# EAGLE design v1 (EAGLE 9.4.1)
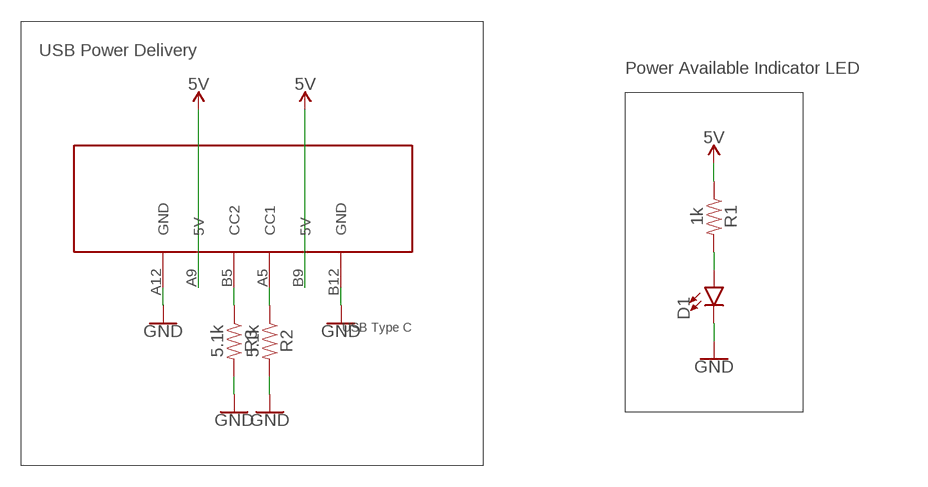
[diagram p0: schematic, sheet 1]

## Parts
D1  LED1206  [LED-1206]
R1  1k  0.75OHM-0805-1/4W-1%  [0805]
R2  5.1k  0.75OHM-0805-1/4W-1%  [0805]
R3  5.1k  0.75OHM-0805-1/4W-1%  [0805]
U$1  USBC6PIN  [USBC6PIN]

## Nets
5V: R1.1 U$1.A9(5V) U$1.B9(5V)
GND: D1.C R2.2 R3.2 U$1.A12(GND) U$1.B12(GND)
N$1: R3.1 U$1.B5(CC2)
N$2: R2.1 U$1.A5(CC1)
N$3: D1.A R1.2

## Notes on the sheet
- USB Power Delivery
- Power Available Indicator LED

## Library data of the parts
D1 = SparkFun-LED:LED: LED (Generic) Standard schematic elements and footprints for 5mm, 3mm, 1206, and 0603 sized LEDs. Generic LEDs with no color specified.
R1-R3 = SparkFun-Resistors:0.75OHM: 0.75Ω resistor A resistor is a passive two-terminal electrical component that implements electrical resistance as a circuit element. Resistors act to reduce current flow, and, at the same time, act to lower voltage levels within circuits. - Wikipedia; PROD_ID: RES-08474; VALUE: 0.75
U$1 = usbc6pin:USBC6PIN

## Board
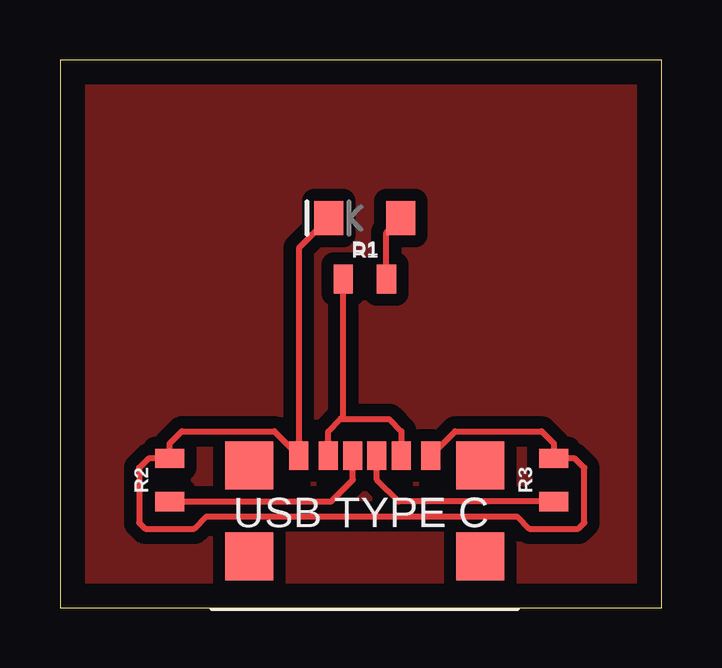
[diagram p1: board, top side]

Size 25.07 x 22.85 mm. Coordinates in mm from the lower left corner, seen from the top.
Outline: 0,0 25.07,0 25.07,22.85 0,22.85 0,0
Copper layers (1*16): Top 0.035mm / dielectric 1.5mm / Bottom 0.035mm
Design rules "default": minimum track width 6mil, minimum drill 0.35mm, track to track 6mil, track to pad 6mil, pad to pad 6mil, via to via 6mil, smd to smd 6mil, copper to edge 40mil, drill to drill 6mil, minimum pad ring 10mil, minimum via ring 8mil, stop-mask expansion 4mil, vias tented up to drill 0mil, thermal gap 10mil

### Footprints (pad centres in the part's own frame; a part is rotated, then mirrored left to right if it is on the bottom)
LED-1206 = smd 1.2 x 1.4: A -1.5,0; C 1.5,0
0805 = smd 0.8 x 1.2: 1 -0.9,0; 2 0.9,0
USBC6PIN = smd 0.8 x 1.2: A5 -0.5,0; A9 1.52,0; A12 2.75,0; B5 0.5,0; B9 -1.52,0; B12 -2.75,0 | smd 2 x 2: P$7 4.82,-0.4; P$8 -4.82,-0.4; P$9 4.82,-4.2; P$10 -4.82,-4.2

### Placement (x,y rotation side)
D1  12.7,16.26 180 top
R1  12.7,13.72 0 top
R2  4.57,5.33 90 top
R3  20.57,5.33 90 top
U$1  12.7,6.35 0 top

### Tracks (layer width: path | path; a pad name or v marks a point on that pad's centre or on a via)
5V
  Top 0.254: U$1.B9 11.18,7.37 11.68,7.87 | 11.68,7.87 13.72,7.87 14.22,7.37 U$1.A9 | 11.68,7.87 11.8,7.99 R1.1
GND
  Top 0.254: U$1.A12 16.47,7.37 20.07,7.37 20.57,6.86 R3.2 21.45,6.23 21.84,5.84 21.84,3.56 21.59,3.3 19.56,3.3 19.05,3.81 6.1,3.81 5.59,3.3 3.56,3.3 3.3,3.56 3.3,5.84 3.69,6.23 R2.2 4.57,6.86 5.08,7.37 8.93,7.37 U$1.B12 9.95,15.01 D1.C
N$1
  Top 0.254: R3.1 14.11,4.43 13.2,5.34 U$1.B5
N$2
  Top 0.254: R2.1 11.29,4.43 12.2,5.34 U$1.A5
N$3
  Top 0.254: R1.2 13.6,15.66 D1.A
NEW
  pour Top (isolate 0.508): 0,22.86 25.4,22.86 25.4,0 0,0